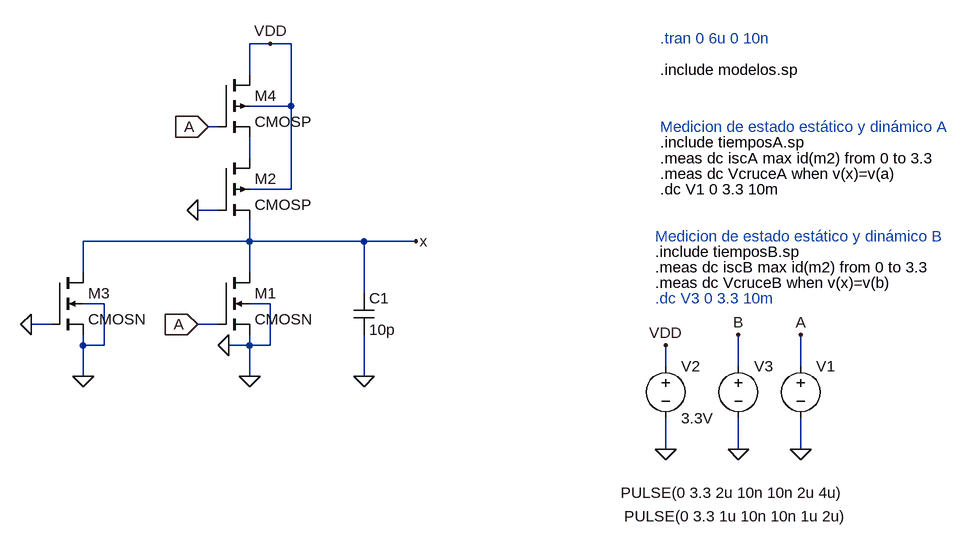
[diagram p0: schematic NOR2mA.asc]
NOR2mA.asc, the LTspice schematic file:
Version 4
SHEET 1 1560 824
WIRE 464 -240 432 -240
WIRE 496 -240 464 -240
WIRE 432 -192 432 -240
WIRE 496 -144 496 -240
WIRE 496 -144 432 -144
WIRE 384 -112 368 -112
WIRE 432 -64 432 -96
WIRE 496 -16 496 -144
WIRE 496 -16 432 -16
WIRE 384 16 352 16
WIRE 432 64 432 32
WIRE 432 64 176 64
WIRE 608 64 432 64
WIRE 688 64 608 64
WIRE 176 112 176 64
WIRE 432 112 432 64
WIRE 608 144 608 64
WIRE 208 160 176 160
WIRE 464 160 432 160
WIRE 128 192 96 192
WIRE 384 192 352 192
WIRE 176 224 176 208
WIRE 208 224 208 160
WIRE 208 224 176 224
WIRE 432 224 432 208
WIRE 432 224 400 224
WIRE 464 224 464 160
WIRE 464 224 432 224
WIRE 1072 256 1072 224
WIRE 1184 256 1184 208
WIRE 1280 256 1280 208
WIRE 176 272 176 224
WIRE 432 272 432 224
WIRE 608 272 608 208
WIRE 1072 384 1072 336
WIRE 1184 384 1184 336
WIRE 1280 384 1280 336
FLAG 1280 384 0
FLAG 432 272 0
FLAG 1072 224 VDD
FLAG 464 -240 VDD
FLAG 1280 208 A
FLAG 352 16 0
IOPIN 352 16 In
FLAG 1072 384 0
FLAG 688 64 x
FLAG 1184 384 0
FLAG 1184 208 B
FLAG 368 -112 A
IOPIN 368 -112 In
FLAG 96 192 0
IOPIN 96 192 In
FLAG 352 192 A
IOPIN 352 192 In
FLAG 176 272 0
FLAG 608 272 0
FLAG 400 224 0
IOPIN 400 224 In
SYMBOL nmos4 384 112 R0
SYMATTR InstName M1
SYMATTR Value CMOSN
SYMATTR Value2 l=0.6u w=7.5u
SYMBOL pmos4 384 -64 R0
SYMATTR InstName M2
SYMATTR Value CMOSP
SYMATTR Value2 l=.6u w=24.6u
SYMBOL voltage 1280 240 R0
WINDOW 3 -272 247 Left 2
WINDOW 123 0 0 Left 0
WINDOW 39 0 0 Left 0
SYMATTR Value PULSE(0 3.3 1u 10n 10n 1u 2u)
SYMATTR InstName V1
SYMBOL voltage 1072 240 R0
WINDOW 123 0 0 Left 0
WINDOW 39 0 0 Left 0
SYMATTR InstName V2
SYMATTR Value 3.3V
SYMBOL cap 592 144 R0
SYMATTR InstName C1
SYMATTR Value 10p
SYMBOL nmos4 128 112 R0
SYMATTR InstName M3
SYMATTR Value CMOSN
SYMATTR Value2 l=0.6u w=7.5u
SYMBOL pmos4 384 -192 R0
SYMATTR InstName M4
SYMATTR Value CMOSP
SYMATTR Value2 l=.6u w=24.6u
SYMBOL voltage 1184 240 R0
WINDOW 3 -181 211 Left 2
WINDOW 123 0 0 Left 0
WINDOW 39 0 0 Left 0
SYMATTR Value PULSE(0 3.3 2u 10n 10n 2u 4u)
SYMATTR InstName V3
TEXT 1064 -200 Left 2 !.include modelos.sp
TEXT 1064 -248 Left 2 ;.tran 0 6u 0 10n
TEXT 1064 -40 Left 2 !.meas dc VcruceA when v(x)=v(a)
TEXT 1064 -88 Left 2 !.include tiemposA.sp
TEXT 1064 -64 Left 2 !.meas dc iscA max id(m2) from 0 to 3.3
TEXT 1064 -112 Left 2 ;Medicion de estado estático y dinámico A
TEXT 1056 128 Left 2 !.meas dc VcruceB when v(x)=v(b)
TEXT 1056 104 Left 2 !.meas dc iscB max id(m2) from 0 to 3.3
TEXT 1056 56 Left 2 ;Medicion de estado estático y dinámico B
TEXT 1056 152 Left 2 ;.dc V3 0 3.3 10m
TEXT 1064 -16 Left 2 !.dc V1 0 3.3 10m
TEXT 1056 80 Left 2 !.include tiemposB.sp

The netlist it stands for:
* NOR2mA.asc
M1 x A 0 0 CMOSN l=0.6u w=7.5u
M2 N001 0 x VDD CMOSP l=.6u w=24.6u
V1 A 0 PULSE(0 3.3 1u 10n 10n 1u 2u)
V2 VDD 0 3.3V
C1 x 0 10p
M3 x 0 0 0 CMOSN l=0.6u w=7.5u
M4 VDD A N001 VDD CMOSP l=.6u w=24.6u
V3 B 0 PULSE(0 3.3 2u 10n 10n 2u 4u)
.model NMOS NMOS
.model PMOS PMOS
.lib standard.mos
.include modelos.sp
* .tran 0 6u 0 10n
.meas dc VcruceA when v(x)=v(a)
.include tiemposA.sp
.meas dc iscA max id(m2) from 0 to 3.3
* Medicion de estado estático y dinámico A
.meas dc VcruceB when v(x)=v(b)
.meas dc iscB max id(m2) from 0 to 3.3
* Medicion de estado estático y dinámico B
* .dc V3 0 3.3 10m
.dc V1 0 3.3 10m
.include tiemposB.sp
.backanno
.end

* Results of the author's LTspice run, read from the files saved beside the schematic
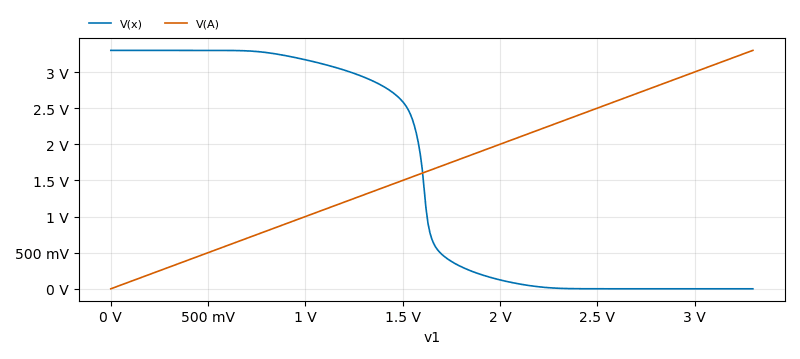
[diagram p1: DC transfer characteristic of NOR2mA.asc, plotted from the saved traces]
* DC transfer characteristic, 1 run:
*   V(x): 3.3 V at v1=0 V, 3.587 nV at v1=3.3 V, min 3.587 nV, max 3.3 V
*   V(A): 0 V at v1=0 V, 3.3 V at v1=3.3 V, min 0 V, max 3.3 V
* From the log:
*   vcrucea: v(x)=v(a) AT 1.60246
*   isca: MAX(id(m2))=0.000588183 FROM 0 TO 3.3
*   Measurement "vcruceb" FAIL'ed
*   iscb: MAX(id(m2))=0.000588183 FROM 0 TO 3.3